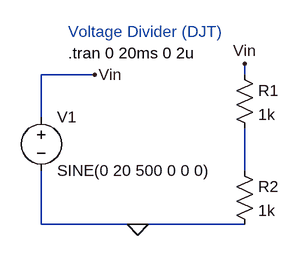
[diagram p0: schematic Draft1.asc]
Draft1.asc, the LTspice schematic file:
Version 4.1
SHEET 1 880 680
WIRE 64 48 -16 48
WIRE 288 48 288 32
WIRE -16 112 -16 48
WIRE 288 192 288 128
WIRE -16 272 -16 192
WIRE 128 272 -16 272
WIRE 288 272 128 272
FLAG 128 272 0
FLAG 64 48 Vin
FLAG 288 32 Vin
SYMBOL voltage -16 96 R0
WINDOW 123 0 0 Left 0
WINDOW 39 0 0 Left 0
SYMATTR InstName V1
SYMATTR Value SINE(0 20 500 0 0 0)
SYMBOL res 272 32 R0
SYMATTR InstName R1
SYMATTR Value 1k
SYMBOL res 272 176 R0
SYMATTR InstName R2
SYMATTR Value 1k
TEXT 24 -16 Left 2 ;Voltage Divider (DJT)
TEXT 24 16 Left 2 !.tran 0 20ms 0 2u

The netlist it stands for:
* Draft1.asc
V1 Vin 0 SINE(0 20 500 0 0 0)
R1 Vin N001 1k
R2 N001 0 1k
* Voltage Divider (DJT)
.tran 0 20ms 0 2u
.backanno
.end